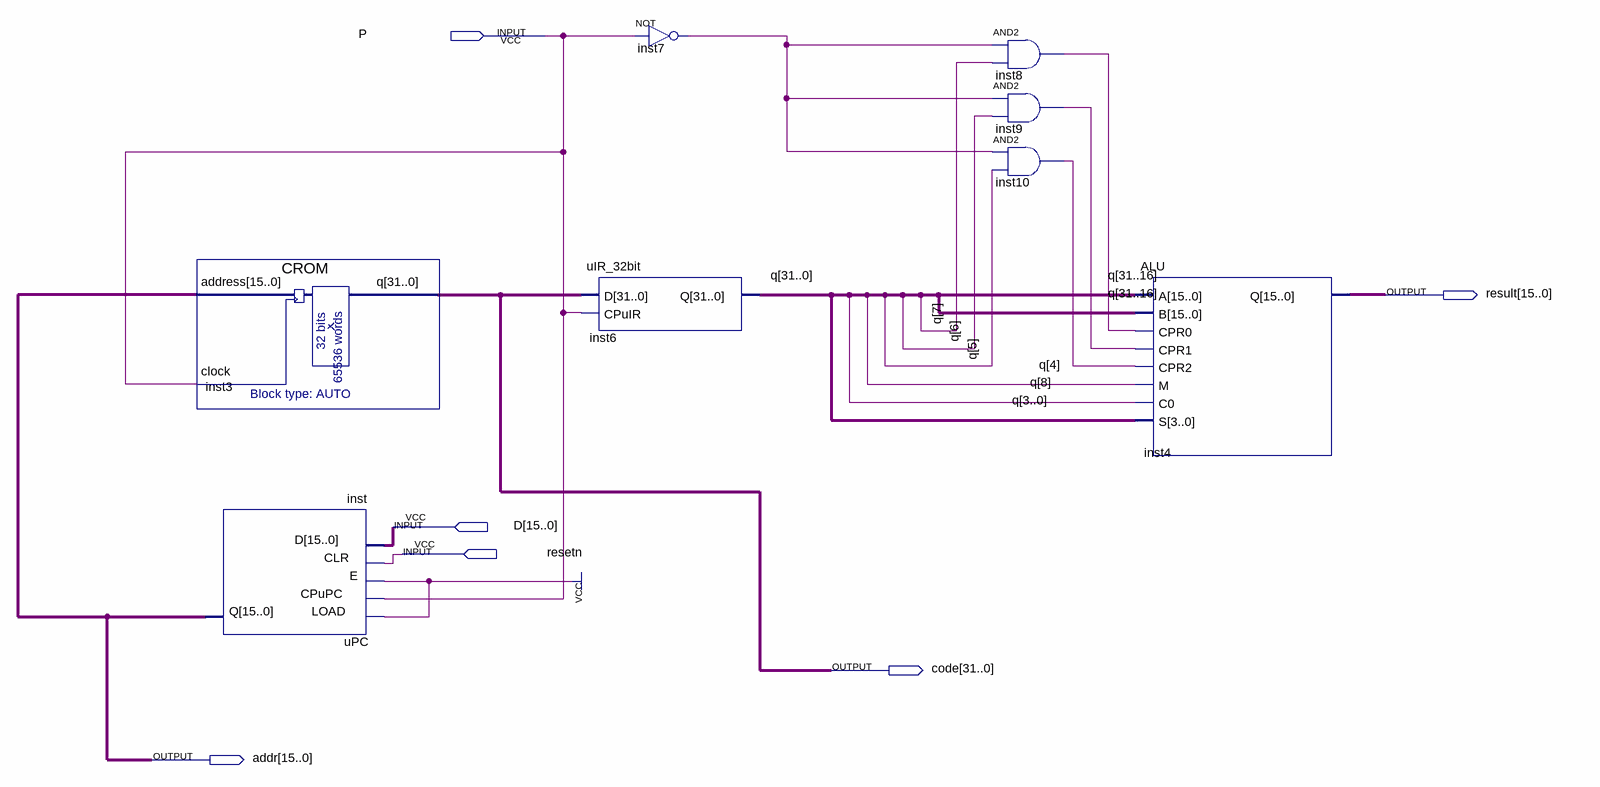
[diagram p0: schematic sheet]
// Quartus schematic CPU.bdf as structural Verilog: 8 symbols, 6 pins
module CPU (
  input  P,
  input  [15:0] D,
  input  resetn,
  output [15:0] result,
  output [31:0] code,
  output [15:0] addr
);

  wire inst7_out, inst8_out, inst9_out, inst10_out;
  wire [31:0] q;

  CROM inst3 (.address(addr), .clock(P), .q(code));
  uPC inst (.LOAD(1'b1), .CPuPC(P), .E(1'b1), .CLR(resetn), .D(D), .Q(addr));
  uIR_32bit inst6 (.D(code), .CPuIR(P), .Q(q));
  not inst7 (inst7_out, P);
  and inst8 (inst8_out, inst7_out, q[7]);
  and inst9 (inst9_out, inst7_out, q[6]);
  and inst10 (inst10_out, inst7_out, q[5]);
  ALU inst4 (
    .A(q[31:16]), .B(q[31:16]), .CPR0(inst8_out), .CPR1(inst9_out), .CPR2(inst10_out), .M(q[4]), .C0(q[8]),
    .S(q[3:0]), .Q(result));
endmodule
